# Altium schematic sheet Power Supply.SchDoc: Power Supply
size A4; Date: 28.08.2010; ApprovedBy: V.Gyurov; CheckedBy: V.Gyurov; Author: V.Gyurov; CompanyName: V.Gyurov; DrawnBy: V.Gyurov; Engineer: V.Gyurov; DocumentNumber: 4; Revision: 00; SheetNumber: 4; SheetTotal: 7; VersionControl_RevNumber: V1.00 R.00; CurrentDate: 28.08.2010; DocumentName: Power Supply
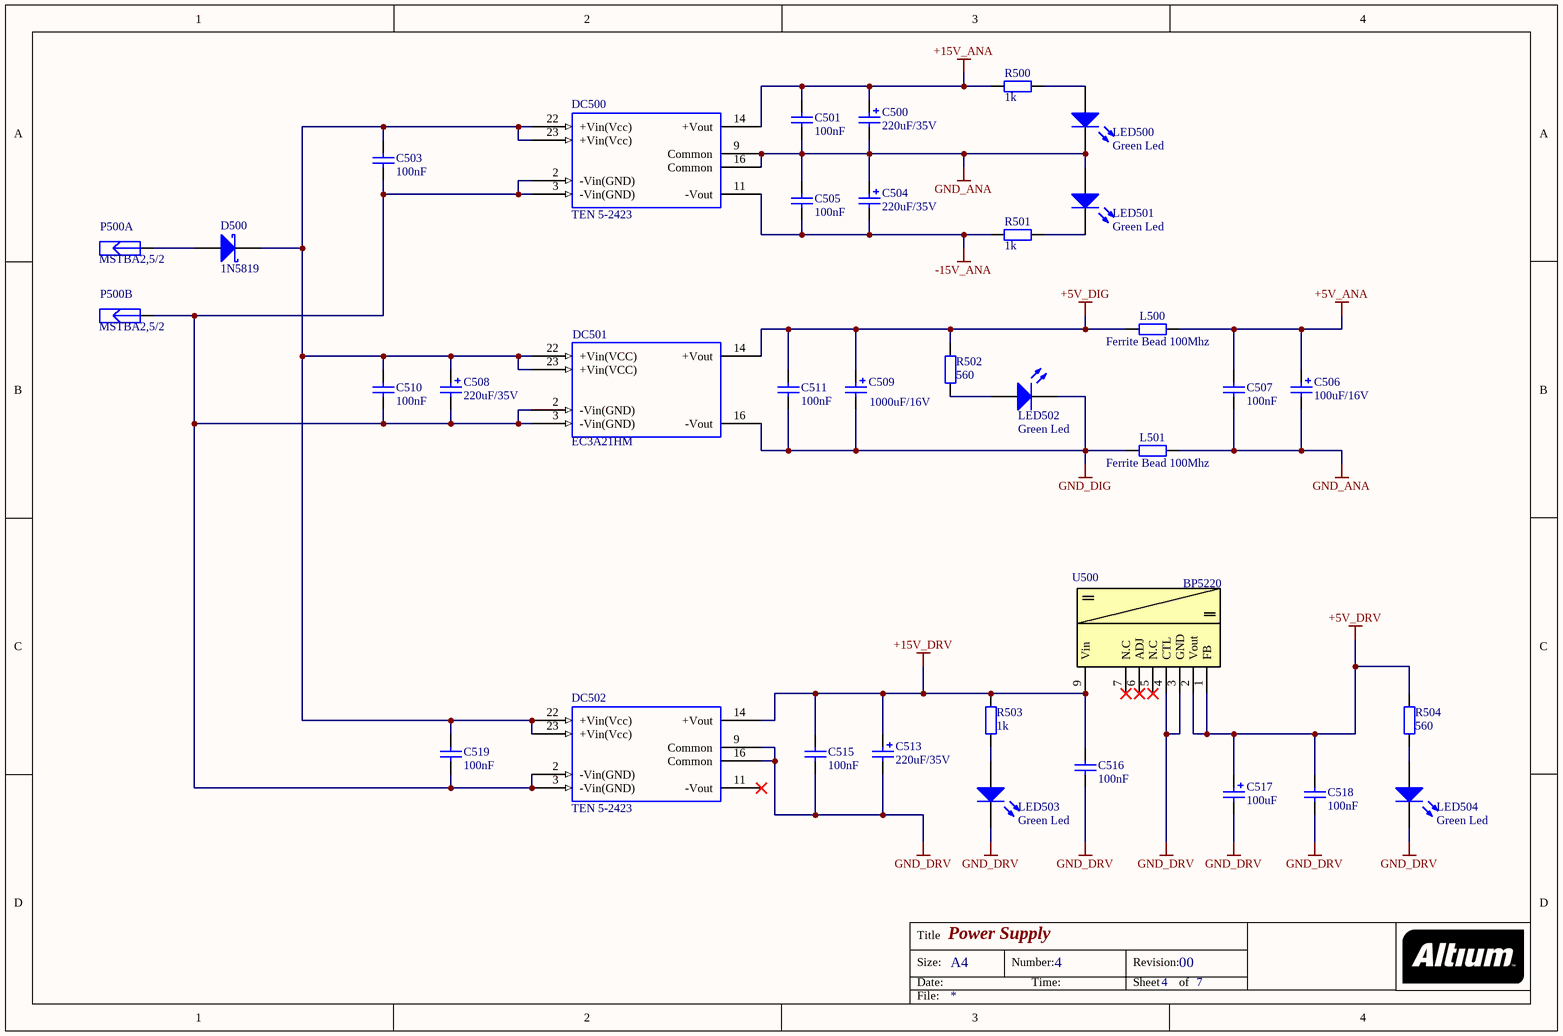
[diagram p0: Power Supply.SchDoc]

## Parts
C500  value 220uF/35V  [CAPPR3.5-8x12]  (hidden comment: Cap)
C501  value 100nF  [1206_REFLOW]  (hidden comment: Cap 1206)
C503  value 100nF  [1206_REFLOW]  (hidden comment: Cap 1206)
C504  value 220uF/35V  [CAPPR3.5-8x12]  (hidden comment: Cap)
C505  value 100nF  [1206_REFLOW]  (hidden comment: Cap 1206)
C506  value 100uF/16V  [CAPPR3.5-8x12]  (hidden comment: Cap)
C507  value 100nF  [1206_REFLOW]  (hidden comment: Cap 1206)
C508  value 220uF/35V  [CAPPR3.5-8x12]  (hidden comment: Cap)
C509  value 1000uF/16V  [CAPPR3.5-8x12]  (hidden comment: Cap)
C510  value 100nF  [1206_REFLOW]  (hidden comment: Cap 1206)
C511  value 100nF  [1206_REFLOW]  (hidden comment: Cap 1206)
C513  value 220uF/35V  [CAPPR3.5-8x12]  (hidden comment: Cap)
C515  value 100nF  [1206_REFLOW]  (hidden comment: Cap 1206)
C516  value 100nF  [1206_REFLOW]  (hidden comment: Cap 1206)
C517  value 100uF  [CAPPR3.5-8x12]  (hidden comment: Cap)
C518  value 100nF  [1206_REFLOW]  (hidden comment: Cap 1206)
C519  value 100nF  [1206_REFLOW]  (hidden comment: Cap 1206)
D500  1N5819  [DO-214_S1A(Primary)]
DC500  TEN 5-2423  [DIP24_TRACO]
DC501  EC3A21HM  [DIP24_TRACO]
DC502  TEN 5-2423  [DIP24_TRACO]
L500  value Ferrite Bead 100Mhz  [3216[1206]]  (hidden comment: RES)
L501  value Ferrite Bead 100Mhz  [3216[1206]]  (hidden comment: RES)
LED500  Green Led  [LED_1206]
LED501  Green Led  [LED_1206]
LED502  Green Led  [LED_1206]
LED503  Green Led  [LED_1206]
LED504  Green Led  [LED_1206]
P500  value MSTBA2,5/2  [MSTB2.5/2-G-5.08]  (hidden comment: MSTBA 2,5/ 2-G-5,08)  (parts A,B of 2)
R500  value 1k  [1206_REFLOW]  (hidden comment: RES)
R501  value 1k  [1206_REFLOW]  (hidden comment: RES)
R502  value 560  [1206_REFLOW]  (hidden comment: RES)
R503  value 1k  [1206_REFLOW]  (hidden comment: RES)
R504  value 560  [1206_REFLOW]  (hidden comment: RES)
U500  value BP5220  [BP5220]  (hidden comment: DC DC ROHM)

## Nets
+5V_ANA: C506.1 C507.2 L500.2
+5V_DIG: C509.1 C511.2 DC501.14(+Vout) L500.1 R502.1
+5V_DRV: C517.1 C518.2 R504.1 U500.1(FB) U500.2(Vout)
+15V_ANA: C500.1 C501.2 DC500.14(+Vout) R500.2
+15V_DRV: C513.1 C515.2 C516.2 DC502.14(+Vout) R503.1 U500.9(Vin)
-15V_ANA: C504.2 C505.1 DC500.11(-Vout) R501.2
GND_ANA: C500.2 C501.1 C504.1 C505.2 C506.2 C507.1 DC500.9(Common) DC500.16(Common) L501.2 LED500.K LED501.A
GND_DIG: C509.2 C511.1 DC501.16(-Vout) L501.1 LED502.K
GND_DRV: C513.2 C515.1 C516.1 C517.2 C518.1 DC502.9(Common) DC502.16(Common) LED503.K LED504.K U500.3(GND) U500.4(CTL)
NetC503_1: C503.1 C508.2 C510.1 C519.1 DC500.2(-Vin(GND)) DC500.3(-Vin(GND)) DC501.2(-Vin(GND)) DC501.3(-Vin(GND)) DC502.2(-Vin(GND)) DC502.3(-Vin(GND)) P500.2(SIG)
NetC503_2: C503.2 C508.1 C510.2 C519.2 D500.K DC500.22(+Vin(Vcc)) DC500.23(+Vin(Vcc)) DC501.22(+Vin(VCC)) DC501.23(+Vin(VCC)) DC502.22(+Vin(Vcc)) DC502.23(+Vin(Vcc))
NetD500_A: D500.A P500.1(SIG)
NetLED500_A: LED500.A R500.1
NetLED501_K: LED501.K R501.1
NetLED502_A: LED502.A R502.2
NetLED503_A: LED503.A R503.2
NetLED504_A: LED504.A R504.2

Not connected (* = marked no-connect by the designer): DC502 11(-Vout)*; U500 5(N.C)* 6(ADJ)* 7(N.C)*

## Notes on the sheet
- Title
- Size:
- Date:
- A4
- Number:
- Time:
- Revision:
- Sheet
- of
- File:

## Library data of the parts
C500 C504 C506 C508 C509 C513 C517 = Cap pol
DC501 = EC3A21HM: DC/DC CONVERTER, 3W 5V; Manufacturer: CINCON; Group: IC; Subgroup: Power Management; Subgroup1: DC-DC Converter; Supplier: Any; Order code: *; Package: DIL24; Mounting: TH; Mfrr. Part No.: EC3A21HM; Value: EC3A21HM
L500 L501 R500-R504 = RES 1
LED500-LED504 = LED: Value: TBD
P500 = MSTBA 2,5/ 2-G-5,08: Header, right angled, 12 A, 250 V, pitch 5.08 mm, No. of poles:2; Manufacturer: Phoenix; Mfrr. Part No.: 1757242; Group: Connector; Subgroup: Industrial; Supplier: Any; Mounting: TH; Package: TH; Order Code: *
U500 = BP5220
D500 = 1N5819: Value: 1N5819
DC500 DC502 = TEN 5-2423: Value: TEN 5-2423